# Altium schematic sheet Top_Level.SchDoc
size A4; SheetNumber: 1; SheetTotal: 8
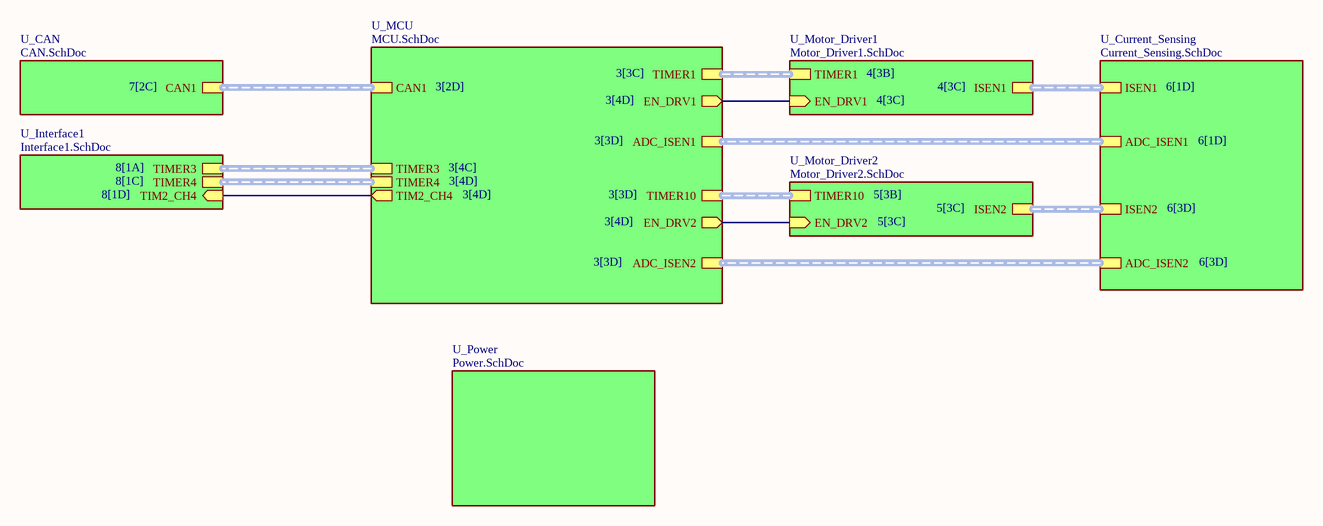
[diagram p0: Top_Level.SchDoc]

## Sub-sheets
U_CAN = CAN.SchDoc: CAN1 (harness CAN1)
U_Current_Sensing = Current_Sensing.SchDoc: ISEN1 (harness ISEN1), ISEN2 (harness ISEN2), ADC_ISEN1 (harness ADC_ISEN1), ADC_ISEN2 (harness ADC_ISEN2)
U_Interface1 = Interface1.SchDoc: TIMER4 (harness TIMER4), TIMER3 (harness TIMER3), TIM2_CH4 (in)
U_MCU = MCU.SchDoc: TIMER1 (harness TIMER1), TIMER10 (harness TIMER10), TIMER4 (harness TIMER4), TIMER3 (harness TIMER3), CAN1 (harness CAN1), ADC_ISEN1 (harness ADC_ISEN1), ADC_ISEN2 (harness ADC_ISEN2), TIM2_CH4 (out), EN_DRV1 (out), EN_DRV2 (out)
U_Motor_Driver1 = Motor_Driver1.SchDoc: TIMER1 (harness TIMER1), ISEN1 (harness ISEN1), EN_DRV1 (in)
U_Motor_Driver2 = Motor_Driver2.SchDoc: TIMER10 (harness TIMER10), ISEN2 (harness ISEN2), EN_DRV2 (in)
U_Power = Power.SchDoc: no entries

## Nets
(unnamed): sheet U_MCU/TIM2_CH4, sheet U_Interface1/TIM2_CH4
(unnamed): sheet U_MCU/EN_DRV1, sheet U_Motor_Driver1/EN_DRV1
(unnamed): sheet U_MCU/EN_DRV2, sheet U_Motor_Driver2/EN_DRV2

## Buses and harness runs
harness sheet U_CAN/CAN1 = sheet U_MCU/CAN1
harness sheet U_Current_Sensing/ADC_ISEN1 = sheet U_MCU/ADC_ISEN1
harness sheet U_Current_Sensing/ADC_ISEN2 = sheet U_MCU/ADC_ISEN2
harness sheet U_Current_Sensing/ISEN1 = sheet U_Motor_Driver1/ISEN1
harness sheet U_Current_Sensing/ISEN2 = sheet U_Motor_Driver2/ISEN2
harness sheet U_Interface1/TIMER3 = sheet U_MCU/TIMER3
harness sheet U_Interface1/TIMER4 = sheet U_MCU/TIMER4
harness sheet U_MCU/TIMER1 = sheet U_Motor_Driver1/TIMER1
harness sheet U_MCU/TIMER10 = sheet U_Motor_Driver2/TIMER10